# EAGLE design bbf-europower (EAGLE 9.6.2)
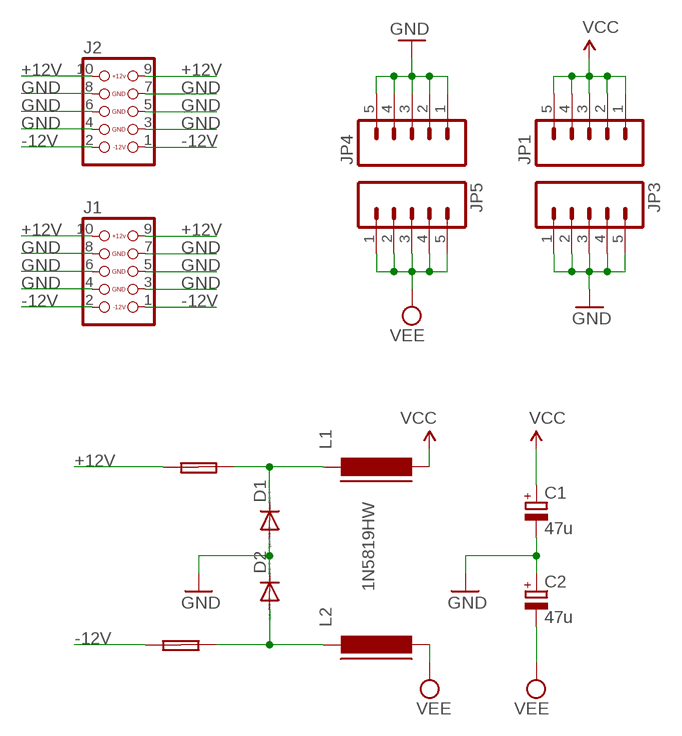
[diagram p0: schematic, sheet 1]

## Parts
+FUSE1  +FUSE  PTC_FUSEPOLY_FUSE  [C050H075X075]
-FUSE1  -FUSE  PTC_FUSEPOLY_FUSE  [C050H075X075]
C1  47u  CPOL-EUE2-5  [E2-5]
C2  47u  CPOL-EUE2-5  [E2-5]
D1  1N5819HW  1N4148DO35-7  [DO35-7]
D2  1N5819HW  1N4148DO35-7  [DO35-7]
J1  CON_HEADER_2X05-PTH  [M2X5]
J2  CON_HEADER_2X05-PTH  [M2X5]
JP1  M05PTH  [1X05]
JP3  M05PTH  [1X05]
JP4  M05PTH  [1X05]
JP5  M05PTH  [1X05]
L1  FERRITE-SHORT  [FBS]
L2  FERRITE-SHORT  [FBS]

## Nets
+12V: +FUSE1.1 J1.9 J1.10 J2.9 J2.10
-12V: -FUSE1.1 J1.1 J1.2 J2.1 J2.2
GND: C1.- C2.+ D1.A D2.C J1.3 J1.4 J1.5 J1.6 J1.7 J1.8 J2.3 J2.4 J2.5 J2.6 J2.7 J2.8 JP3.1 JP3.2 JP3.3 JP3.4 JP3.5 JP4.1 JP4.2 JP4.3 JP4.4 JP4.5
N$38: +FUSE1.2 D1.C L1.1
N$39: -FUSE1.2 D2.A L2.1
VCC: C1.+ JP1.1 JP1.2 JP1.3 JP1.4 JP1.5 L1.2
VEE: C2.- JP5.1 JP5.2 JP5.3 JP5.4 JP5.5 L2.2

## Library data of the parts
+FUSE1 -FUSE1 = TomW:PTC_FUSE
C1 C2 = resistor:CPOL-EU: POLARIZED CAPACITOR, European symbol
D1 D2 = diode:1N4148: DIODE high speed (Philips)
J1 J2 = tomatek:CON_HEADER_2X05: 2x05 pin header
JP1 JP3-JP5 = SparkFun:M05: Header 5 Standard 5-pin 0.1" header. Use with straight break away headers (SKU : PRT-00116), right angle break away headers (PRT-00553), swiss pins (PRT-00743), machine pins (PRT-00117), and female headers (PRT-00115). Molex polarized connector foot print use with SKU : PRT-08230 with associated crimp pins and housings.
L1 L2 = GazJ:FERRITE: Ferrite bead in various packages

## Net classes
1 power: width 0.406 mm
2 ground: width 0.406 mm

## Board
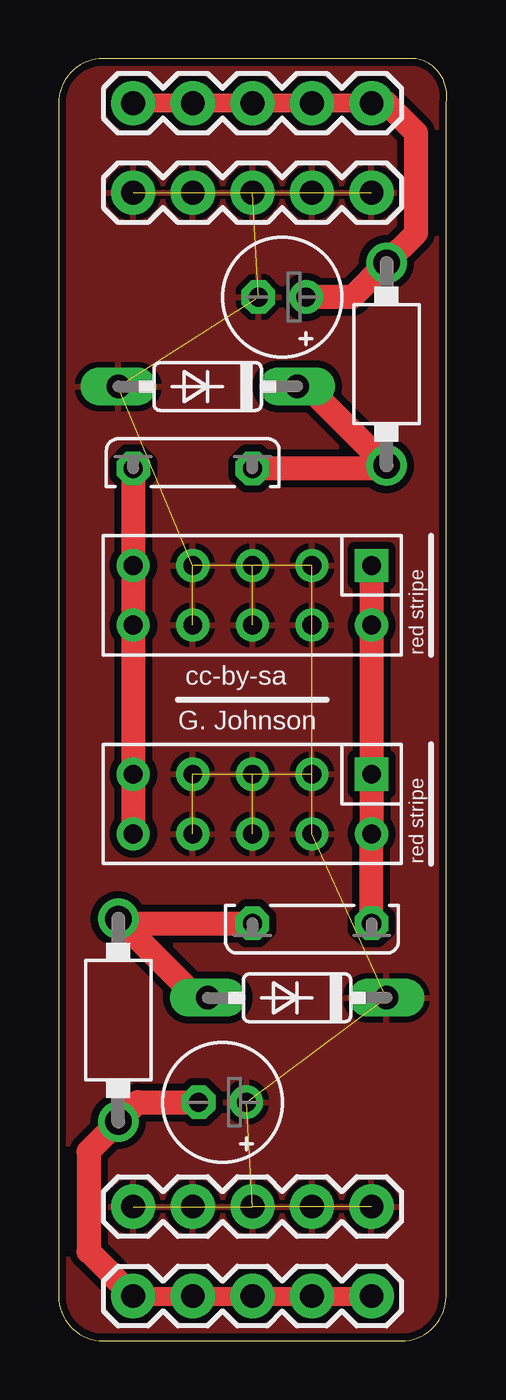
[diagram p1: board, top side]
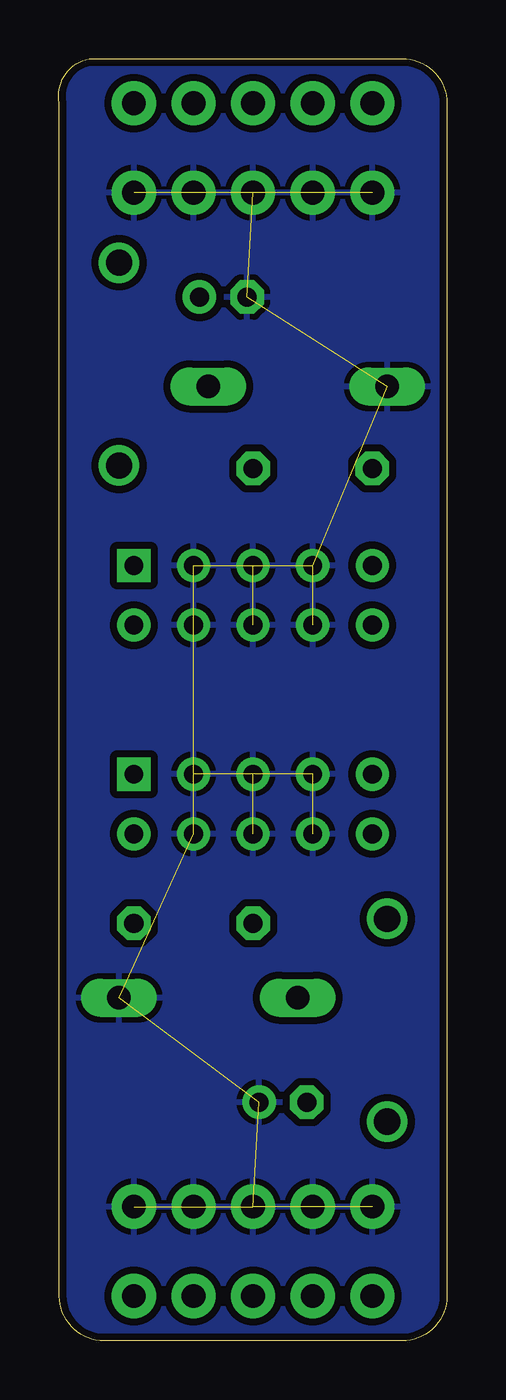
[diagram p2: board, bottom side, seen from below]

Size 16.54 x 54.6 mm. Coordinates in mm from the lower left corner, seen from the top.
Outline: 14.61,0 arc90 16.51,1.91 16.51,52.71 arc90 15.25,54.6 1.9,54.6 arc90 0,52.71 0,1.91 arc90 1.91,0 14.61,0
Copper layers (1*16): Top 0.035mm / dielectric 1.5mm / Bottom 0.035mm
Design rules "SparkFun_10mil *": minimum track width 8mil, minimum drill 20mil, track to track 8mil, track to pad 8mil, pad to pad 8mil, via to via 8mil, smd to smd 8mil, copper to edge 8mil, drill to drill 8mil, minimum pad ring 12mil, minimum via ring 10mil, stop-mask expansion 4mil, vias tented up to drill 25mil, thermal gap 10mil

### Footprints (pad centres in the part's own frame; a part is rotated, then mirrored left to right if it is on the bottom)
C050H075X075 = drill 0.813 octagon: 1 -2.54,0; 2 2.54,0
E2-5 = drill 0.813 pad 1.27: + -1.016,0 | drill 0.813 pad 1.27 octagon: - 1.016,0
DO35-7 = drill 1 long: A 3.81,0; C -3.81,0
M2X5 = drill 0.8 square: 1 -5.08,-1.27 | drill 0.8: 2 -5.08,1.27; 3 -2.54,-1.27; 4 -2.54,1.27; 5 0,-1.27; 6 0,1.27; 7 2.54,-1.27; 8 2.54,1.27; 9 5.08,-1.27; 10 5.08,1.27
1X05 = drill 1.016 pad 1.88: 1 0,0; 2 2.54,0; 3 5.08,0; 4 7.62,0; 5 10.16,0
FBS = drill 1.118: 1 -4.318,0; 2 4.318,0

### Placement (x,y rotation side)
+FUSE1  5.71,37.15 0 top
-FUSE1  10.79,17.78 180 top
C1  9.53,44.45 180 top
C2  6.99,10.16 180 top
D1  6.35,40.64 180 top
D2  10.16,14.61 180 top
J1  8.26,31.75 180 top
J2  8.26,22.86 180 top
JP1  3.17,52.71 0 top
JP3  3.17,48.9 0 top
JP4  3.17,5.71 0 top
JP5  3.17,1.91 0 top
L1  13.97,41.59 90 top
L2  2.54,13.65 270 top

### Tracks (layer width: path | path; a pad name or v marks a point on that pad's centre or on a via)
+12V
  Top 1.016: J2.10 J2.9 J1.10 J1.9 +FUSE1.1
-12V
  Top 1.016: J1.1 J1.2 J2.1 J2.2 -FUSE1.1
GND  (25 unrouted)
  pour Bottom (isolate 0.305): 14.61,0 arc90 16.51,1.91 16.51,53.34 arc90 15.24,54.61 1.91,54.61 arc90 0,52.71 0,1.91 arc90 1.91,0
  pour Top (isolate 0.305): 14.61,0 arc90 16.51,1.91 16.51,53.34 arc90 15.24,54.61 1.91,54.61 arc90 0,52.71 0,1.91 arc90 1.91,0
N$38
  Top 1.016: +FUSE1.2 13.84,37.15 L1.1 10.6,40.64 D1.C
N$39
  Top 1.016: D2.A 5.91,14.61 L2.1 2.73,17.78 -FUSE1.2
VCC
  Top 0.813: JP1.5 JP1.4 JP1.3 JP1.2 JP1.1
  Top 1.016: C1.+ 12.51,44.45 L1.2 15.24,47.18 15.24,51.44 13.97,52.71 JP1.5
VEE
  Top 0.813: JP5.1 JP5.2 JP5.3 JP5.4 JP5.5
  Top 1.016: JP5.1 1.27,3.81 1.27,8.06 L2.2 3.37,10.16 C2.-

### Text on the board
tNames: red stripe | cc-by-sa | G. Johnson | red stripe